# EAGLE schematic untitled (EAGLE 5.06)
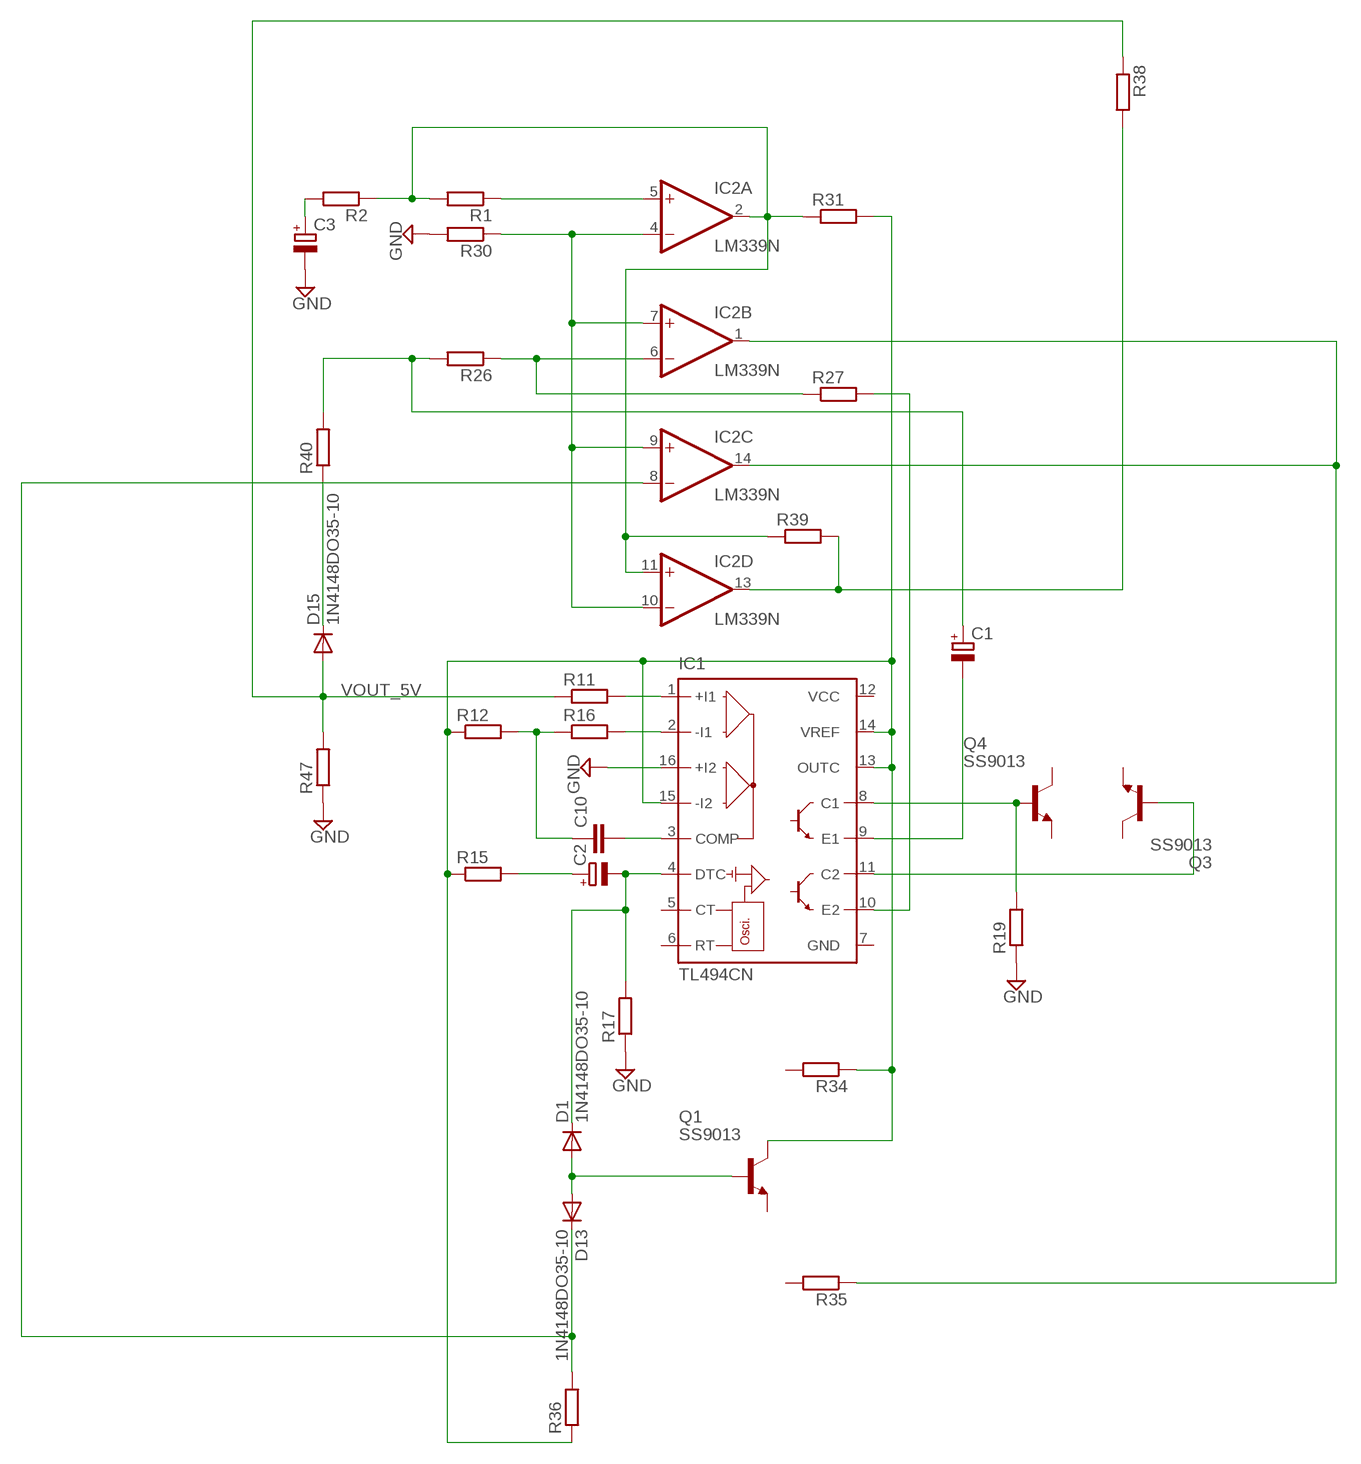
[diagram p0: schematic, sheet 1]

## Parts
C1  CPOL-EUE2.5-6  [E2,5-6]
C2  CPOL-EUE2.5-6  [E2,5-6]
C3  CPOL-EUE2.5-6  [E2,5-6]
C10  C-EU050-024X044  [C050-024X044]
D1  1N4148DO35-10  [DO35-10]
D13  1N4148DO35-10  [DO35-10]
D15  1N4148DO35-10  [DO35-10]
IC1  TL494CN  [DIL16]
IC2  LM339N  [DIL14]
Q1  SS9013  -NPN-TO92  [TO92]
Q3  SS9013  -NPN-TO92  [TO92]
Q4  SS9013  -NPN-TO92  [TO92]
R1  R-EU_0309/12  [0309/12]
R2  R-EU_0309/12  [0309/12]
R11  R-EU_0309/12  [0309/12]
R12  R-EU_0309/12  [0309/12]
R15  R-EU_0309/12  [0309/12]
R16  R-EU_0309/12  [0309/12]
R17  R-EU_0309/12  [0309/12]
R19  R-EU_0309/12  [0309/12]
R26  R-EU_0309/12  [0309/12]
R27  R-EU_0309/12  [0309/12]
R30  R-EU_0309/12  [0309/12]
R31  R-EU_0309/12  [0309/12]
R34  R-EU_0309/12  [0309/12]
R35  R-EU_0309/12  [0309/12]
R36  R-EU_0309/12  [0309/12]
R38  R-EU_0309/12  [0309/12]
R39  R-EU_0309/12  [0309/12]
R40  R-EU_0309/12  [0309/12]
R47  R-EU_0309/12  [0309/12]

## Nets
C14: C1.- IC1.9(E1)
GND: C3.- IC1.16(+I2) R17.1 R19.1 R30.2 R47.1
N$1: IC1.8(C1) Q4.2(B) R19.2
N$2: IC1.11(C2) Q3.2(B)
N$3: C10.1 R12.2 R16.1
N$4: IC1.2(-I1) R16.2
N$5: C10.2 IC1.3(COMP)
N$6: IC1.1(+I1) R11.2
N$7: D15.C R40.1
N$8: IC2.6(B:-IN) R26.1 R27.1
N$9: IC1.10(E2) R27.2
N$10: C1.+ R26.2 R40.2
N$11: IC2.2(A:OUT) IC2.11(D:+IN) R1.2 R2.1 R31.1 R39.1
N$12: IC2.13(D:OUT) R38.2 R39.2
N$13: IC1.13(OUTC) IC1.14(VREF) IC1.15(-I2) Q1.3(C) R12.1 R15.1 R31.2 R34.1 R36.1
N$14: C2.+ R15.2
N$15: C2.- D1.C IC1.4(DTC) R17.2
N$16: D1.A D13.A Q1.2(B)
N$17: D13.C IC2.8(C:-IN) R36.2
N$18: IC2.1(B:OUT) IC2.14(C:OUT) R35.1
N$19: IC2.4(A:-IN) IC2.7(B:+IN) IC2.9(C:+IN) IC2.10(D:-IN) R30.1
N$20: IC2.5(A:+IN) R1.1
N$22: C3.+ R2.2
VOUT_5V: D15.A R11.1 R38.1 R47.2
Unconnected: IC1.5(CT) IC1.6(RT) Q1.1(E) Q3.1(E) Q3.3(C) Q4.1(E) Q4.3(C) R34.2 R35.2

## Power pins joined to a net without a drawn wire
GND: IC1.7(GND) IC2.12(P:GND)
V+: IC2.3(P:V+)
VCC: IC1.12(VCC)

## Library data of the parts
C1-C3 = rcl:CPOL-EU: POLARIZED CAPACITOR, European symbol
C10 = rcl:C-EU: CAPACITOR, European symbol
D1 D13 D15 = diode:1N4148: DIODE high speed (Philips)
IC1 = linear:TL494*: SWITCHMODE Pulse Width Modulation Control Circuit NCV494B http://onsemi.com tl494-d.pdf
IC2 = linear:LM339: Low Power Low Offset Voltage Quad Comparators with open collector; LM139/LM239/LM339/LM2901/LM3302
Q1 Q3 Q4 = transistor:*-NPN-: NPN Transistror BF959 corrected 2008.03.06
R1 R2 R11 R12 R15-R17 R19 R26 R27 R30 R31 R34-R36 R38-R40 R47 = rcl:R-EU_: RESISTOR, European symbol